# Altium schematic sheet STC89C52RC.SchDoc
size A3; SheetNumber: 1; SheetTotal: 1
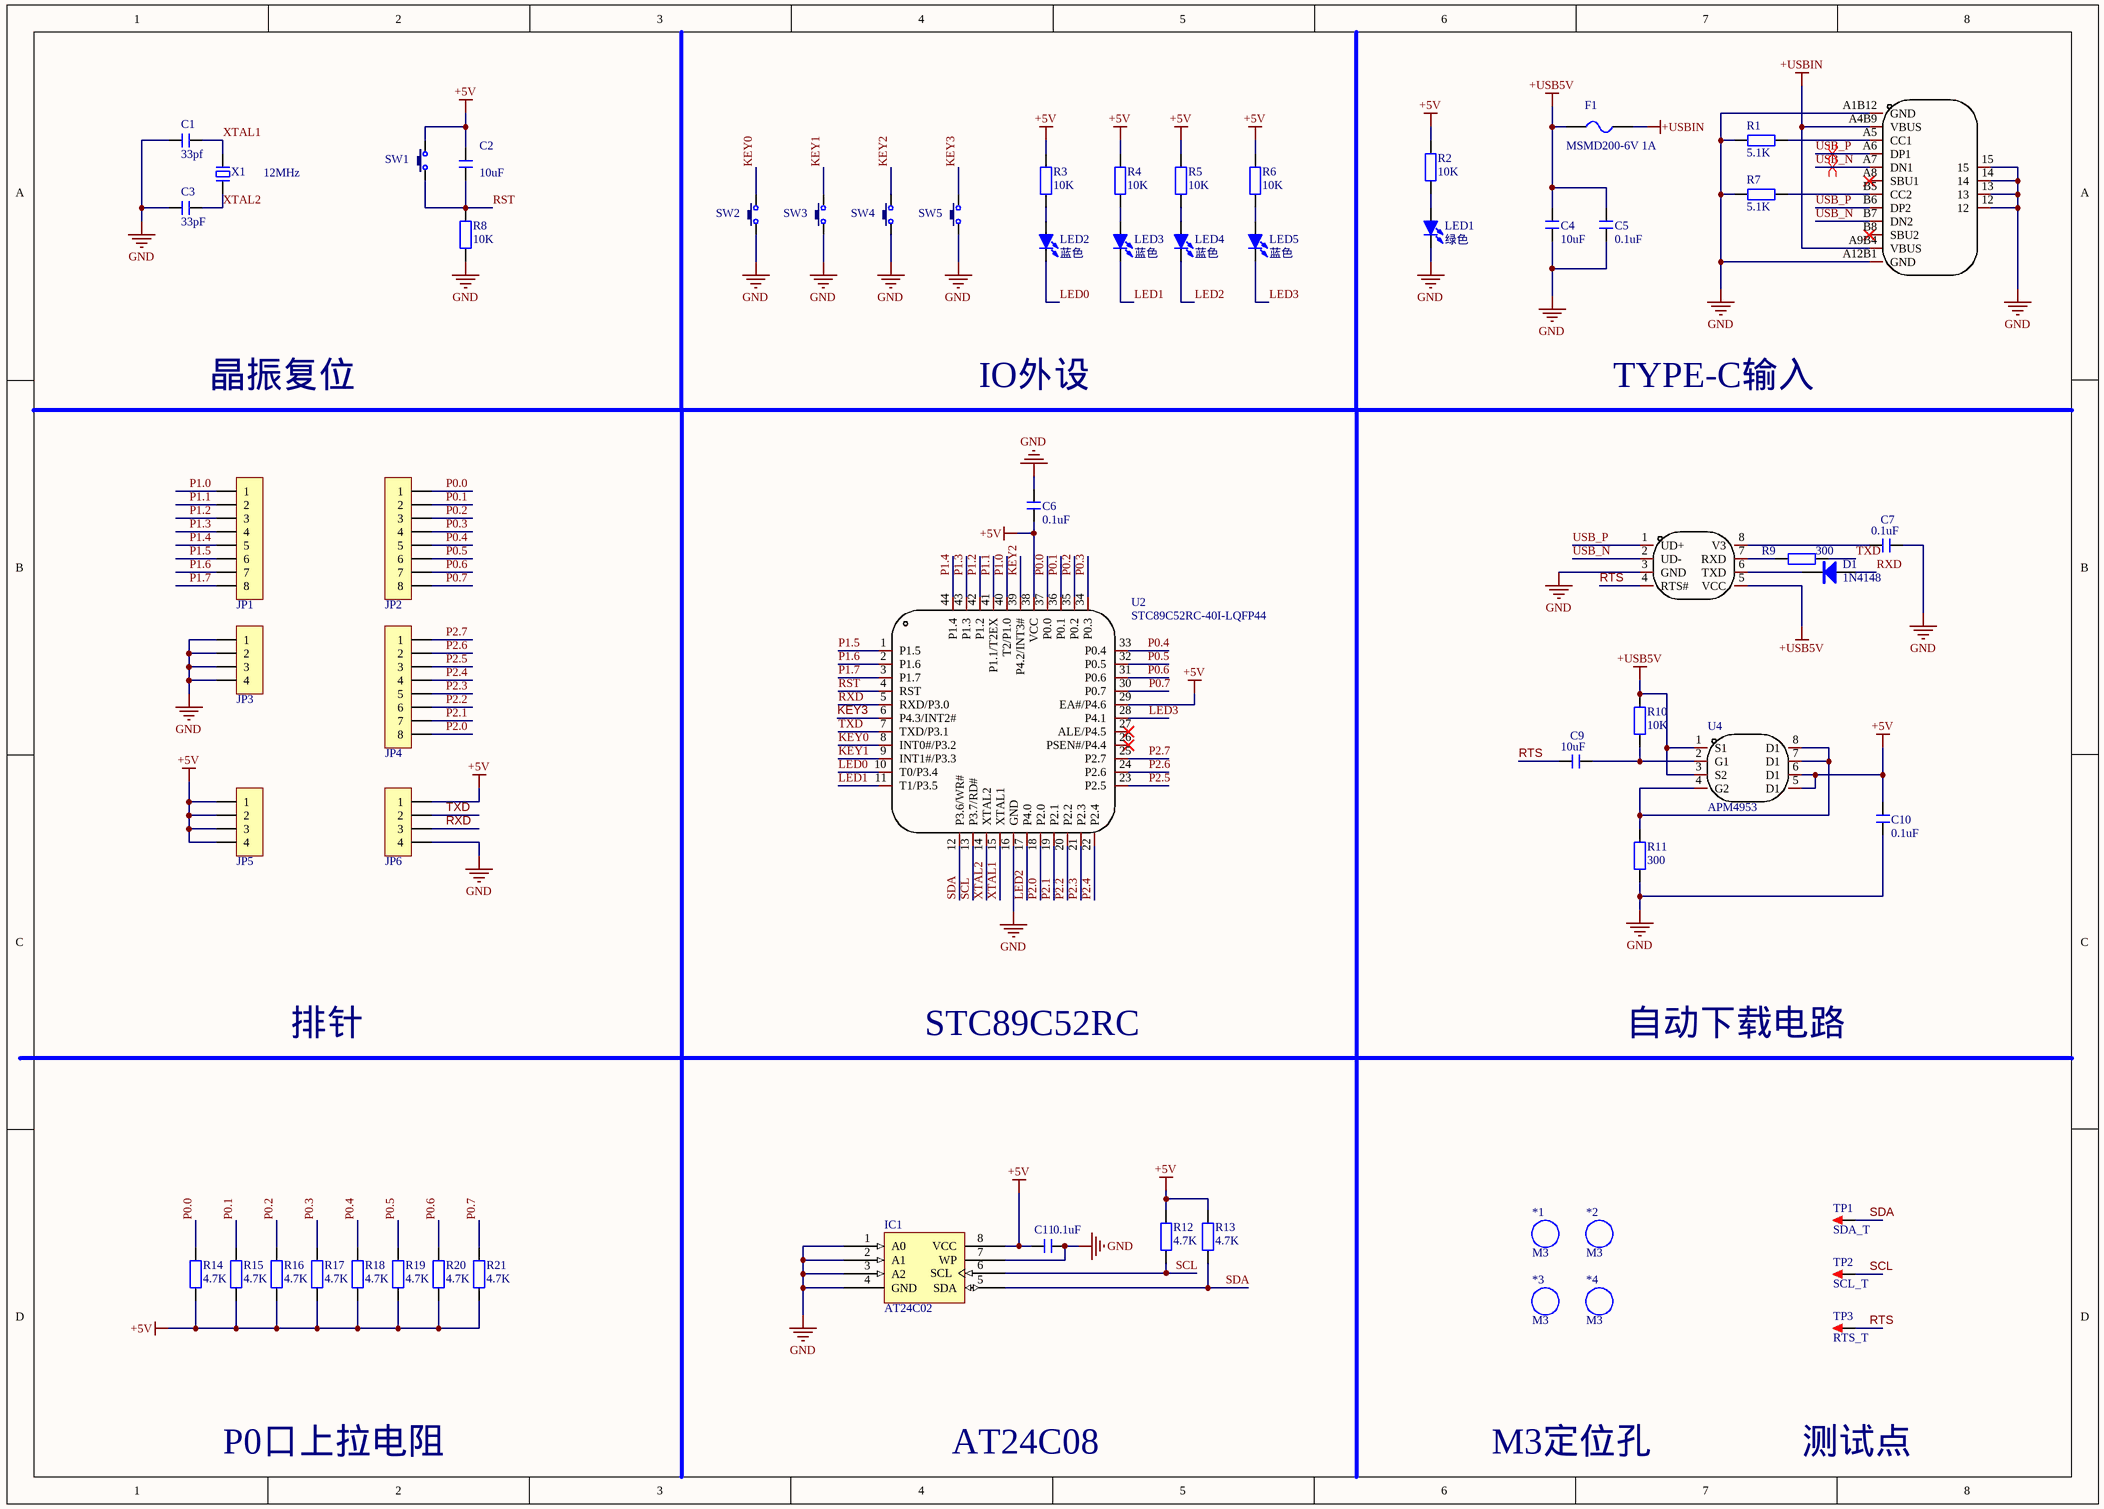
[diagram p0: STC89C52RC.SchDoc]

## Parts
*1  M3  [M3 125X200]
*2  M3  [M3 125X200]
*3  M3  [M3 125X200]
*4  M3  [M3 125X200]
C1  33pf  [C 0805_L]
C2  10uF  [C 0805_L]
C3  33pF  [C 0805_L]
C4  10uF  [C 0805_L]
C5  0.1uF  [C 0805_L]
C6  0.1uF  [C 0805_L]
C7  0.1uF  [C 0805_L]
C9  10uF  [C 0805_L]
C10  0.1uF  [C 0805_L]
C11  0.1uF  [C 0805_L]
D1  1N4148  [SOD-323]
F1  MSMD200-6V 1A  [FU 0805]
IC1  AT24C02  [SOP8_N]
JP1  HDR-1X8  [HDR2.54-LI-8P]  (value not drawn)
JP2  HDR-1X8  [HDR2.54-LI-8P]  (value not drawn)
JP3  HDR-1X4  [HDR2.54-LI-4P]  (value not drawn)
JP4  HDR-1X8  [HDR2.54-LI-8P]  (value not drawn)
JP5  HDR-1X4  [HDR2.54-LI-4P]  (value not drawn)
JP6  HDR-1X4  [HDR2.54-LI-4P]  (value not drawn)
LED1  绿色  [LED 0805G]
LED2  蓝色  [LED 0805B]
LED3  蓝色  [LED 0805B]
LED4  蓝色  [LED 0805B]
LED5  蓝色  [LED 0805B]
R1  5.1K  [R 0805_L]
R2  10K  [R 0805_L]
R3  10K  [R 0805_L]
R4  10K  [R 0805_L]
R5  10K  [R 0805_L]
R6  10K  [R 0805_L]
R7  5.1K  [R 0805_L]
R8  10K  [R 0805_L]
R9  300  [R 0805_L]
R10  10K  [R 0805_L]
R11  300  [R 0805_L]
R12  4.7K  [R 0805_L]
R13  4.7K  [R 0805_L]
R14  4.7K  [R 0805_L]
R15  4.7K  [R 0805_L]
R16  4.7K  [R 0805_L]
R17  4.7K  [R 0805_L]
R18  4.7K  [R 0805_L]
R19  4.7K  [R 0805_L]
R20  4.7K  [R 0805_L]
R21  4.7K  [R 0805_L]
SW1  3x6x5  [TSW SMD-3*6*2.5]  (value not drawn)
SW2  3x6x5  [TSW SMD-3*6*2.5]  (value not drawn)
SW3  3x6x5  [TSW SMD-3*6*2.5]  (value not drawn)
SW4  3x6x5  [TSW SMD-3*6*2.5]  (value not drawn)
SW5  3x6x5  [TSW SMD-3*6*2.5]  (value not drawn)
TP1  SDA_T  [TEST 1.2]
TP2  SCL_T  [TEST 1.2]
TP3  RTS_T  [TEST 1.2]
U1  YTC-TC16S-24  [USB-C-SMD_YTC-TC16S-24]  (value not drawn)
U2  STC89C52RC  [LQFP44 10X10_N]  (value not drawn)
U3  CH340N  [SOP8_L]  (value not drawn)
U4  APM4953  [SOP8]
X1  12MHz  [OSC 5032-2P]

## Nets
+5V: C2.1 C6.2 C10.1 C11.1 IC1.8(VCC) JP5.1 JP5.2 JP5.3 JP5.4 JP6.1 R2.2 R3.2 R4.2 R5.2 R6.2 R12.2 R13.2 R14.1 R15.1 R16.1 R17.1 R18.1 R19.1 R20.1 R21.1 SW1.2 U2.29(EA#/P4.6) U2.38(VCC) U4.5(D1) U4.6(D1)
+USB5V: C4.2 C5.2 F1.1 R10.2 U3.5(VCC) U4.1(S1) U4.3(S2)
+USBIN: F1.2 U1.A4B9(VBUS) U1.A9B4(VBUS)
GND: C1.2 C3.2 C4.1 C5.1 C6.1 C7.2 C10.2 C11.2 IC1.1(A0) IC1.2(A1) IC1.3(A2) IC1.4(GND) IC1.7(WP) JP3.1 JP3.2 JP3.3 JP3.4 JP6.4 LED1.2(K) R1.1 R7.1 R8.1 R11.1 SW2.1 SW3.1 SW4.1 SW5.1 U1.12 U1.13 U1.14 U1.15 U1.A1B12(GND) U1.A12B1(GND) U2.16(GND) U3.3(GND)
KEY0: SW2.2 U2.8(INT0#/P3.2)
KEY1: SW3.2 U2.9(INT1#/P3.3)
KEY2: SW4.2 U2.39(P4.2/INT3#)
KEY3: SW5.2 U2.6(P4.3/INT2#)
LED0: LED2.2(K) U2.10(T0/P3.4)
LED1: LED3.2(K) U2.11(T1/P3.5)
LED2: LED4.2(K) U2.17(P4.0)
LED3: LED5.2(K) U2.28(P4.1)
P0.0: JP2.1 R14.2 U2.37(P0.0)
P0.1: JP2.2 R15.2 U2.36(P0.1)
P0.2: JP2.3 R16.2 U2.35(P0.2)
P0.3: JP2.4 R17.2 U2.34(P0.3)
P0.4: JP2.5 R18.2 U2.33(P0.4)
P0.5: JP2.6 R19.2 U2.32(P0.5)
P0.6: JP2.7 R20.2 U2.31(P0.6)
P0.7: JP2.8 R21.2 U2.30(P0.7)
P1.0: JP1.1 U2.40(T2/P1.0)
P1.1: JP1.2 U2.41(P1.1/T2EX)
P1.2: JP1.3 U2.42(P1.2)
P1.3: JP1.4 U2.43(P1.3)
P1.4: JP1.5 U2.44(P1.4)
P1.5: JP1.6 U2.1(P1.5)
P1.6: JP1.7 U2.2(P1.6)
P1.7: JP1.8 U2.3(P1.7)
P2.0: JP4.8 U2.18(P2.0)
P2.1: JP4.7 U2.19(P2.1)
P2.2: JP4.6 U2.20(P2.2)
P2.3: JP4.5 U2.21(P2.3)
P2.4: JP4.4 U2.22(P2.4)
P2.5: JP4.3 U2.23(P2.5)
P2.6: JP4.2 U2.24(P2.6)
P2.7: JP4.1 U2.25(P2.7)
RST: C2.2 R8.2 SW1.1 U2.4(RST)
RTS: C9.1 TP3.1 U3.4(RTS#)
RXD: D1.1(A) JP6.3 U2.5(RXD/P3.0)
SCL: IC1.6(SCL) R12.1 TP2.1 U2.13(P3.7/RD#)
SDA: IC1.5(SDA) R13.1 TP1.1 U2.12(P3.6/WR#)
TXD: JP6.2 R9.2 U2.7(TXD/P3.1)
USB_N: U1.A7(DN1) U1.B7(DN2) U3.2(UD-)
USB_P: U1.A6(DP1) U1.B6(DP2) U3.1(UD+)
XTAL1: C1.1 U2.15(XTAL1) X1.1
XTAL2: C3.1 U2.14(XTAL2) X1.2
NetC7_1: C7.1 U3.8(V3)
NetC9_2: C9.2 R10.1 U4.2(G1)
NetD1_2: D1.2(K) U3.6(TXD)
NetLED1_1: LED1.1(A) R2.1
NetLED2_1: LED2.1(A) R3.1
NetLED3_1: LED3.1(A) R4.1
NetLED4_1: LED4.1(A) R5.1
NetLED5_1: LED5.1(A) R6.1
NetR1_2: R1.2 U1.A5(CC1)
NetR7_2: R7.2 U1.B5(CC2)
NetR9_1: R9.1 U3.7(RXD)
NetR11_2: R11.2 U4.4(G2) U4.7(D1) U4.8(D1)

Not connected (* = marked no-connect by the designer): U1 A8(SBU1)* B8(SBU2)*; U2 26(PSEN#/P4.4)* 27(ALE/P4.5)*

## Layout directives
differential pair: USB_N, USB_P

## Notes on the sheet
- 晶振复位
- IO外设
- TYPE-C输入
- 排针
- STC89C52RC
- 自动下载电路
- P0口上拉电阻
- AT24C08
- M3定位孔
- 测试点

## Library data of the parts
*1-*4 = M3: 铜柱孔; 版权归属: 封装库来自淘宝 ID：黄晶宝石; BOM名称: 铜柱孔; 学习资源: https://shop463601444.taobao.com
C1-C7 C9-C11 = C: 无极性贴片电容; 版权归属: 源创客; BOM名称: 无极性贴片电容; 学习资源: www.ooocke.com
D1 = 1N4148: 高速开关二极管; 版权归属: 源创客; BOM名称: 高速开关二极管; 学习资源: www.ooocke.com
F1 = FU: 贴片保险丝; 版权归属: 封装库来自淘宝卖家 ID：黄晶宝石; BOM名称: 贴片保险丝; 学习资源: https://shop463601444.taobao.com
IC1 = 24Cxx: 外置EEPROM; 版权归属: 源创客; BOM名称: 外置EEPROM; 学习资源: www.ooocke.com
JP1 JP2 JP4 = Header 8: 8P接插件; 学习资源: 最新版本发布https://item.taobao.com/item.htm?id=566775463719; 版权归属: 封装库来自淘宝 ID：黄晶宝石; BOM名称: 8P接插件
JP3 JP5 JP6 = Header 4: 4P接插件; 版权归属: 封装库来自淘宝 ID：黄晶宝石; 学习资源: 最新版本发布https://item.taobao.com/item.htm?id=566775463719; BOM名称: 4P接插件
LED1-LED5 = LED-SMD: 贴片LED; 版权归属: 源创客; BOM名称: 贴片LED; 学习资源: www.ooocke.com
R1-R21 = R: 贴片电阻; 版权归属: 源创客; BOM名称: 贴片电阻; 学习资源: www.ooocke.com
SW1-SW5 = TSW 3x6: 3x6轻触开关; 版权归属: 源创客; BOM名称: 3x6轻触开关; 学习资源: www.ooocke.com
TP1-TP3 = TEST: 测试点; 版权归属: 封装库来自淘宝 ID：黄晶宝石; BOM名称: 测试点; 学习资源: https://shop463601444.taobao.com
U1 = YTC-TC16S-24: Manufacturer: YIYUAN(怡远); Add into BOM: yes; Connector Type: Type-C; Gender: 母座; Number of Contacts: 16; Number of Ports: 1; Name: YTC-TC16S-24; Symbol: YTC-TC16S-24; Device: YTC-TC16S-24; LCSC Part Name: TypeC母座16P板上SMT前插后贴 TPS; Supplier Part: C2927291; Manufacturer Part: YTC-TC16S-24; Supplier Footprint: SMD; JLCPCB Part Class: Extended Part; Datasheet: https://atta.szlcsc.com/upload/public/pdf/source/20211202/1C566B96B20A064D4B3B2AEC8C704FE6.pdf; Supplier: LCSC; Convert to PCB: yes; Standard: -; Mounting Style: 卧贴; link: https://atta.szlcsc.com/upload/public/pdf/source/20211202/1C566B96B20A064D4B3B2AEC8C704FE6.pdf
U2 = STC89C52RC-40I-LQFP44: CPU内核:51系列;CPU最大主频:-;程序存储容量:8KB;程序存储器类型:FLASH;RAM总容量:512Byte;GPIO端口数量:39;; Manufacturer: STC(宏晶); Symbol: STC89C52RC-40I_C8707; Add into BOM: yes; CPU Core: 51系列; Operating Voltage Range: 3.3V~5.5V; Program Storage Size: 8KB; Program Memory Type: FLASH; GPIO Ports Number: 39; 16Bit Timer: 3; UART/USART: 1; Peripheral/Function: 看门狗; Watchdog: 有; Name: STC89C52RC-40I-LQFP44; Device: STC89C52RC-40I-LQFP44; LCSC Part Name: 51系列; Supplier Part: C8707; Manufacturer Part: STC89C52RC-40I-LQFP44; Supplier Footprint: LQFP-44(10x10); JLCPCB Part Class: 扩展库; Datasheet: https://atta.szlcsc.com/upload/public/pdf/source/20120807/1457706521177.pdf; Supplier: LCSC; Convert to PCB: yes; CPU Maximum Speed: -; RAM Size: 512Byte; EEPROM: -; ADC (Bit): -; DAC (Bit): -; PWM (Bit): -; 8Bit Timer: -; 32Bit Timer: -; CAN: -; I2C: -; I2S: -; SPI: -; Universal Serial Bus: -; Internal Comparator: -; communication protocol: -; Real-Time Clock: -; Infrared Data Association: -; Low-Voltage Detect: -; CCP Capture/Compare: -; Secure Digital Input and Output: -; Direct Memory Access: -; Internal Oscillator: -; Operating Temperature Range: -40℃~+85℃
U3 = CH340N: Manufacturer: WCH(南京沁恒); Symbol: CH340N_C2977777; Add into BOM: yes; Name: CH340N; Device: CH340N; LCSC Part Name: USB转串口芯片 CH340; Supplier Part: C2977777; Manufacturer Part: CH340N; Supplier Footprint: SOP-8; JLCPCB Part Class: Extended Part; Datasheet: https://atta.szlcsc.com/upload/public/pdf/source/20220223/82A45E4FF89B3EDCAD50B354450A7EF4.pdf; Supplier: LCSC; Convert to PCB: yes
U4 = APM4953: 场效应管
X1 = XTAL-2P: 2脚无源脚晶振; 版权归属: 源创客; BOM名称: 2脚无源脚晶振; 学习资源: www.ooocke.com